# Altium schematic sheet 51最小系统.SchDoc
size A4
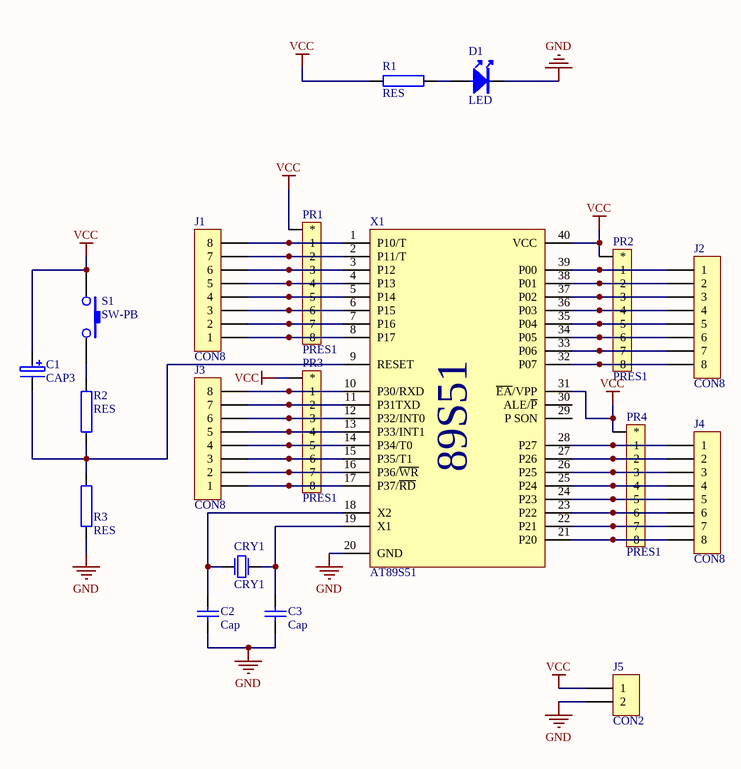
[diagram p0: 51最小系统.SchDoc]

## Parts
C1  CAP3  [CAO1]
C2  Cap  [CAP2]
C3  Cap  [CAP2]
CRY1  CRY1  [JZ1]
D1  LED  [LED2]
J1  CON8  [sip-8]
J2  CON8  [sip-8]
J3  CON8  [sip-8]
J4  CON8  [sip-8]
J5  CON2  [sip-2]
PR1  PRES1  [RP1]
PR2  PRES1  [RP1]
PR3  PRES1  [RP1]
PR4  PRES1  [RP1]
R1  RES  [AXIAL0.3]
R2  RES  [AXIAL0.3]
R3  RES  [AXIAL0.3]
S1  SW-PB  [SW6*6]
X1  AT89S51  [DIP-40]

## Nets
GND: C2.1 C3.1 D1.2 J5.2 R3.1 X1.20(GND)
VCC: C1.1 J5.1 PR1.1 PR2.1 PR3.1 PR4.1 R1.1 S1.1 X1.31(~{EA}/VPP) X1.40(VCC)
NetC1_2: C1.2 R2.1 R3.2 X1.9(RESET)
NetC2_2: C2.2 CRY1.1(P1) X1.18(X2)
NetC3_2: C3.2 CRY1.2(P2) X1.19(X1)
NetD1_1: D1.1 R1.2
NetJ1_1: J1.1 PR1.9(8) X1.8(P17)
NetJ1_2: J1.2 PR1.8(7) X1.7(P16)
NetJ1_3: J1.3 PR1.7(6) X1.6(P15)
NetJ1_4: J1.4 PR1.6(5) X1.5(P14)
NetJ1_5: J1.5 PR1.5(4) X1.4(P13)
NetJ1_6: J1.6 PR1.4(3) X1.3(P12)
NetJ1_7: J1.7 PR1.3(2) X1.2(P11/T)
NetJ1_8: J1.8 PR1.2(1) X1.1(P10/T)
NetJ2_1: J2.1 PR2.2(1) X1.39(P00)
NetJ2_2: J2.2 PR2.3(2) X1.38(P01)
NetJ2_3: J2.3 PR2.4(3) X1.37(P02)
NetJ2_4: J2.4 PR2.5(4) X1.36(P03)
NetJ2_5: J2.5 PR2.6(5) X1.35(P04)
NetJ2_6: J2.6 PR2.7(6) X1.34(P05)
NetJ2_7: J2.7 PR2.8(7) X1.33(P06)
NetJ2_8: J2.8 PR2.9(8) X1.32(P07)
NetJ3_1: J3.1 PR3.9(8) X1.17(P37/~{RD})
NetJ3_2: J3.2 PR3.8(7) X1.16(P36/~{WR})
NetJ3_3: J3.3 PR3.7(6) X1.15(P35/T1)
NetJ3_4: J3.4 PR3.6(5) X1.14(P34/T0)
NetJ3_5: J3.5 PR3.5(4) X1.13(P33/INT1)
NetJ3_6: J3.6 PR3.4(3) X1.12(P32/INT0)
NetJ3_7: J3.7 PR3.3(2) X1.11(P31TXD)
NetJ3_8: J3.8 PR3.2(1) X1.10(P30/RXD)
NetJ4_1: J4.1 PR4.2(1) X1.28(P27)
NetJ4_2: J4.2 PR4.3(2) X1.27(P26)
NetJ4_3: J4.3 PR4.4(3) X1.26(P25)
NetJ4_4: J4.4 PR4.5(4) X1.25(P24)
NetJ4_5: J4.5 PR4.6(5) X1.24(P23)
NetJ4_6: J4.6 PR4.7(6) X1.23(P22)
NetJ4_7: J4.7 PR4.8(7) X1.22(P21)
NetJ4_8: J4.8 PR4.9(8) X1.21(P20)
NetR2_2: R2.2 S1.2

Not connected (* = marked no-connect by the designer): X1 29(P_SON) 30(ALE/~{P})

## Notes on the sheet
- (in symbol AT89S51) 89S51

## Library data of the parts
C2 C3 = Cap: Capacitor; Published: 8-Jun-2000; LatestRevisionDate: 17-Jul-2002; LatestRevisionNote: Re-released for DXP Platform.; PackageReference: RAD-0.3; Publisher: Altium Limited
CRY1 = CRY1: 6.0000 8.000  11.0592  12.0000 24.000
J1-J4 = CON8: Connector
J5 = CON2: Connector